# Altium schematic sheet VLC_TX.SchDoc
size A4; SheetNumber: 1; SheetTotal: 3
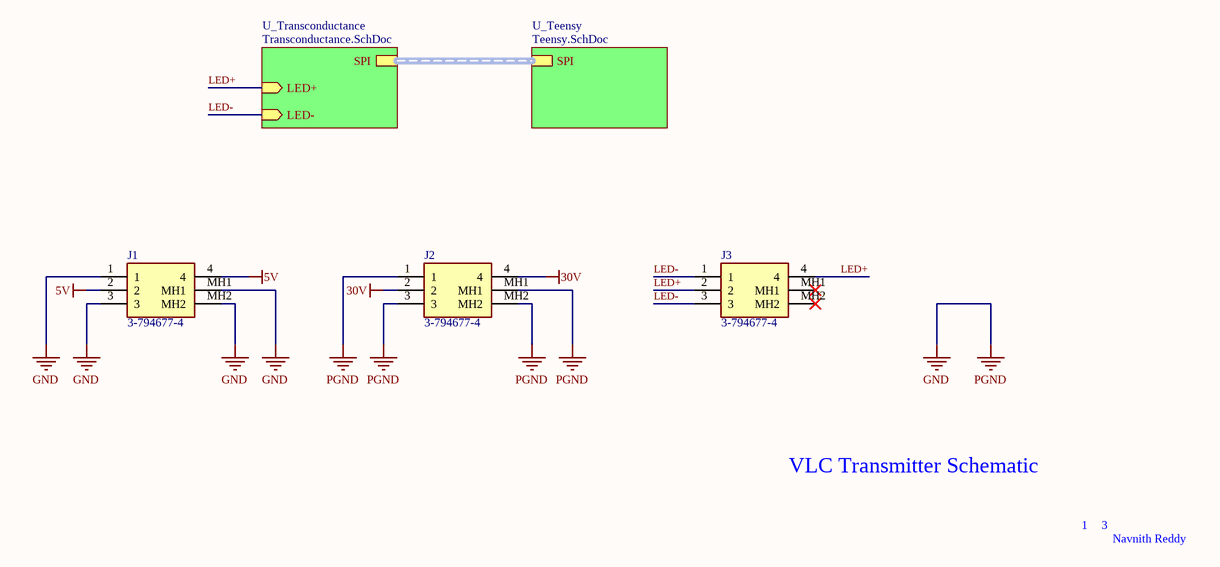
[diagram p0: VLC_TX.SchDoc]

## Parts
J1  3-794677-4  [37946774]
J2  3-794677-4  [37946774]
J3  3-794677-4  [37946774]

## Sub-sheets
U_Teensy = Teensy.SchDoc: SPI (harness SPI)
U_Transconductance = Transconductance.SchDoc: SPI (harness SPI), LED+ (in), LED- (in)

## Nets
5V: J1.2 J1.4
30V: J2.2 J2.4
GND: J1.1 J1.3 J1.MH1 J1.MH2 J2.1 J2.3 J2.MH1 J2.MH2  [also labelled PGND]
LED+: J3.2 J3.4 ; sheet U_Transconductance/LED+
LED-: J3.1 J3.3 ; sheet U_Transconductance/LED-

Not connected (* = marked no-connect by the designer): J3 MH1* MH2*

## Buses and harness runs
harness sheet U_Teensy/SPI = sheet U_Transconductance/SPI

## Notes on the sheet
- VLC Transmitter Schematic
- 1
- 3
- Navnith Reddy

## Library data of the parts
J1-J3 = 3-794677-4: Connector; Manufacturer_Name: TE Connectivity; Description: Configuration Features: Number of Rows 2 | PCB Mount Orientation Right Angle | Number of Power Positions 4 | Number of Positions 4 | Contact Features: PCB Contact Termination Area Plating Material Tin | Contact Type Pin | Contact Current Rating (Max) 5 AMP | PCB Contact Termination Area Plating Material Thickness 100 MICIN | PCB Contact Termination Area Plating Material Thickness 2.54 MICM | Multiple Contact Types Without | Contact Mating Area Plating Material Tin | Contact Mating Area Plating Material Thic; Datasheet Link: https://www.te.com/commerce/DocumentDelivery/DDEController?Action=srchrtrv&DocNm=micro-mate-n-lok-connector-qrg&DocType=Data%20Sheet&DocLang=English&PartCntxt=3-794677-4&DocFormat=pdf; Height: 8.67mm; Manufacturer_Part_Number: 3-794677-4; Mouser Part Number: 571-3-794677-4; Mouser Price/Stock: https://www.mouser.co.uk/ProductDetail/TE-Connectivity-AMP/3-794677-4?qs=6xDM53S3Z3IXPJK6%252BrOgPw%3D%3D; Arrow Part Number: 3-794677-4; Arrow Price/Stock: https://www.arrow.com/en/products/3-794677-4/te-connectivity?region=europe